# EAGLE schematic switch_hat (EAGLE 7.5.0)
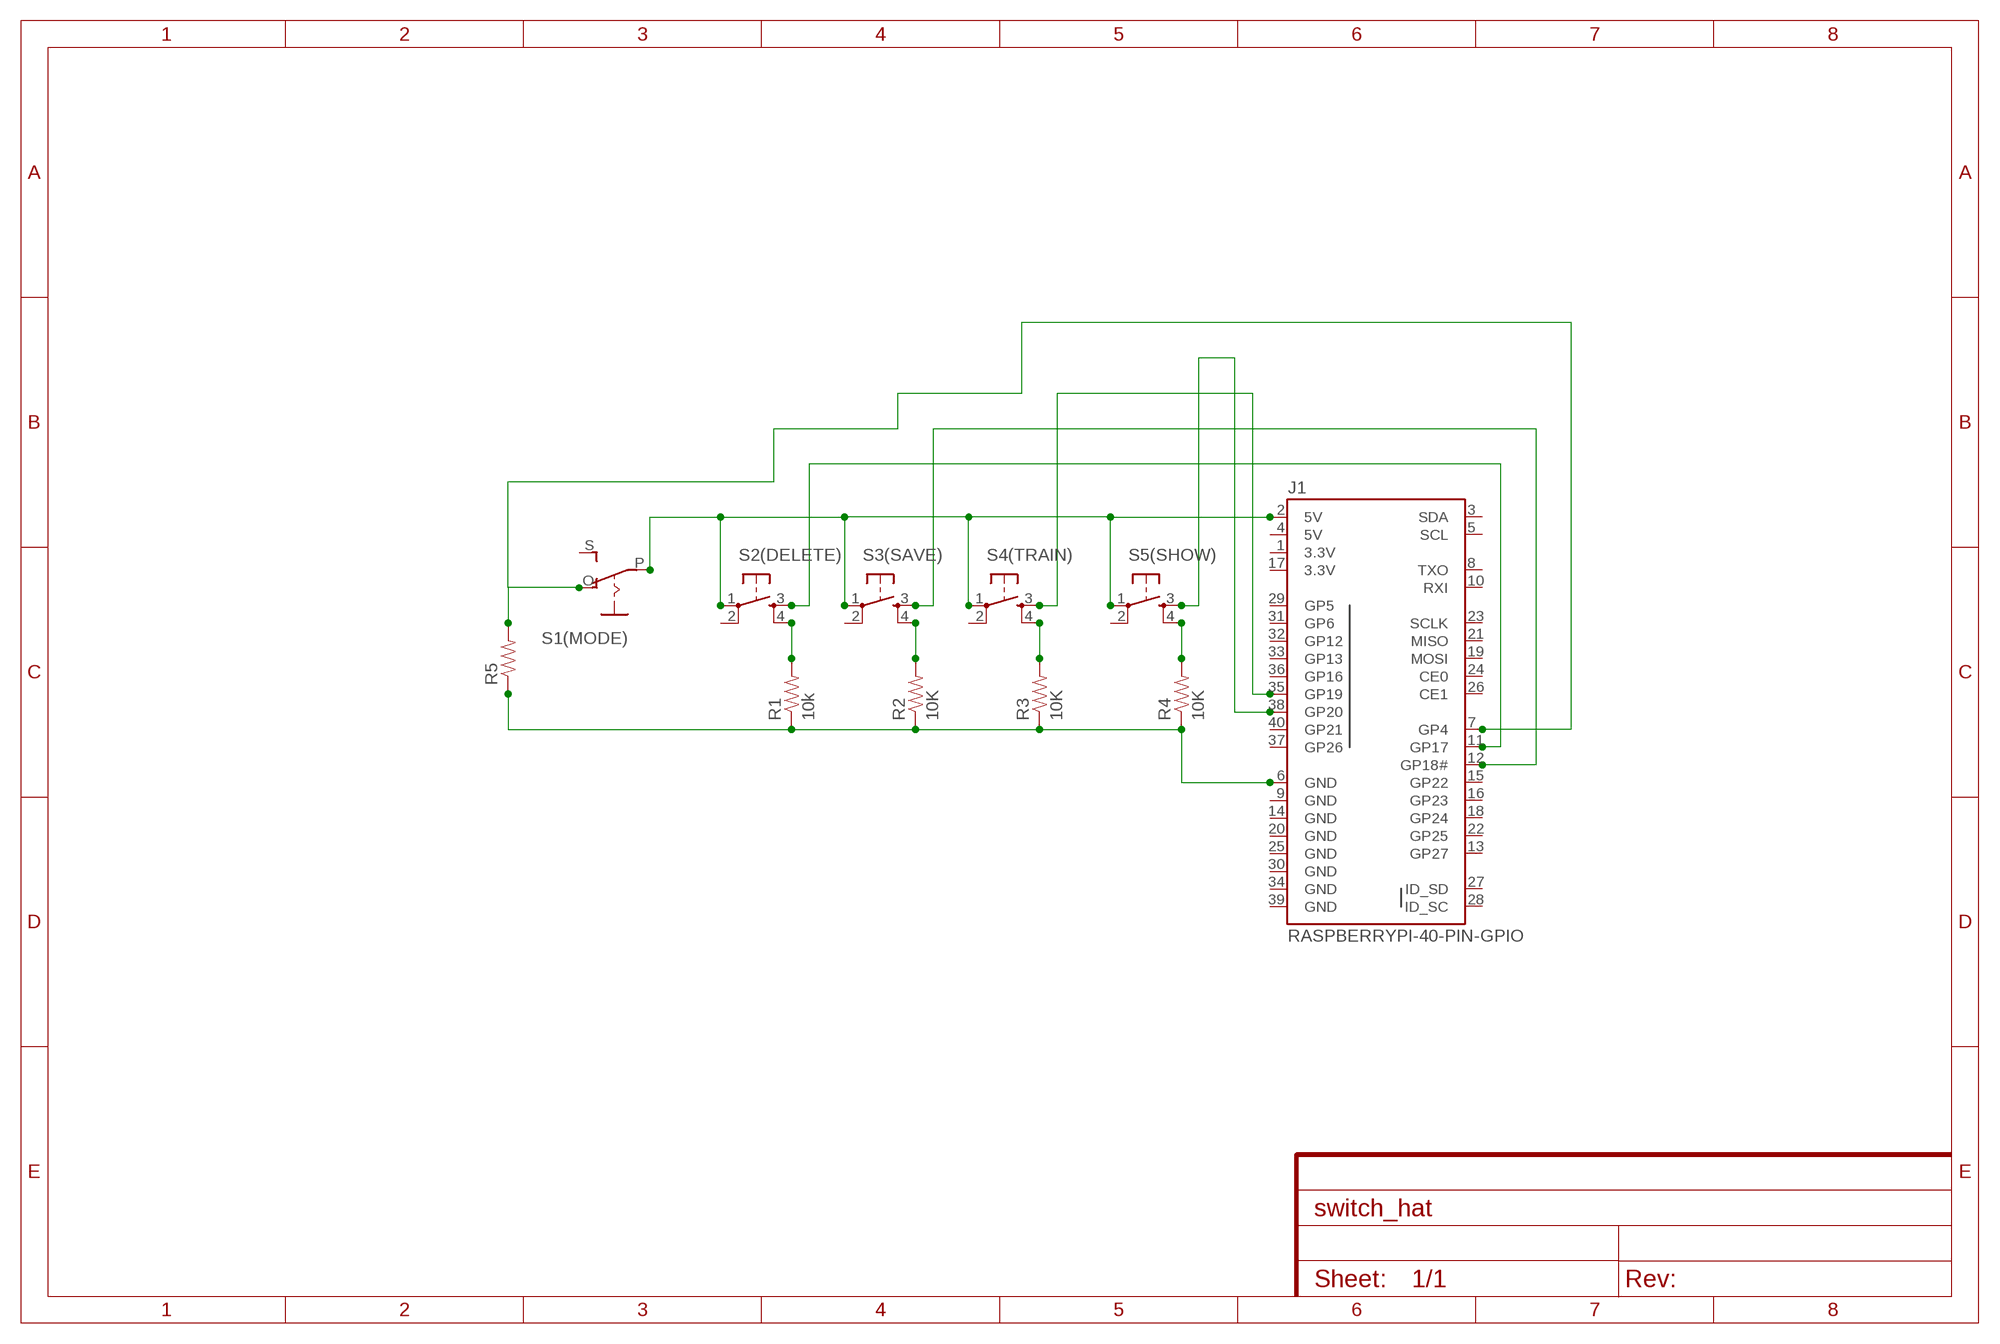
[diagram p0: schematic, sheet 1]

## Parts
J1  RASPBERRYPI-40-PIN-GPIO  [2X20-SHROUDED]
R1  10k  RESISTORPTH-1/4W  [AXIAL-0.4]
R2  10K  RESISTORPTH-1/4W  [AXIAL-0.4]
R3  10K  RESISTORPTH-1/4W  [AXIAL-0.4]
R4  10K  RESISTORPTH-1/4W  [AXIAL-0.4]
R5  RESISTORPTH-1/4W  [AXIAL-0.4]
S1(MODE)  EG1218S  [EG1218]
S2(DELETE)  TAC_SWITCHPTH  [TACTILE-PTH]
S3(SAVE)  TAC_SWITCHPTH  [TACTILE-PTH]
S4(TRAIN)  TAC_SWITCHPTH  [TACTILE-PTH]
S5(SHOW)  TAC_SWITCHPTH  [TACTILE-PTH]

## Nets
N$1: R1.P$2 S2(DELETE).4
N$2: R2.P$2 S3(SAVE).4
N$3: R3.P$2 S4(TRAIN).4
N$4: R4.P$2 S5(SHOW).4
N$5: J1.6(GND) R1.P$1 R2.P$1 R3.P$1 R4.P$1 R5.P$1
N$6: J1.7(GP4) R5.P$2 S1(MODE).O
N$7: J1.11(GP17) S2(DELETE).3
N$8: J1.2(5V) S1(MODE).P S2(DELETE).1 S3(SAVE).1 S4(TRAIN).1 S5(SHOW).1
N$9: J1.12(GP18#) S3(SAVE).3
N$10: J1.35(GP19) S4(TRAIN).3
N$11: J1.38(GP20) S5(SHOW).3
Unconnected: J1.3(SDA) J1.5(SCL) J1.8(TXO) J1.10(RXI) J1.13(GP27) J1.15(GP22) J1.16(GP23) J1.18(GP24) J1.19(MOSI) J1.21(MISO) J1.22(GP25) J1.23(SCLK) J1.24(CE0) J1.26(CE1) J1.27(ID_SD) J1.28(ID_SC) J1.29(GP5) J1.31(GP6) J1.32(GP12) J1.33(GP13) J1.36(GP16) J1.37(GP26) J1.40(GP21) S1(MODE).S S2(DELETE).2 S3(SAVE).2 S4(TRAIN).2 S5(SHOW).2

## Power pins joined to a net without a drawn wire
3.3V: J1.1(3.3V) J1.17(3.3V)
5V: J1.4(5V)
GND: J1.9(GND) J1.14(GND) J1.20(GND) J1.25(GND) J1.30(GND) J1.34(GND) J1.39(GND)

## Library data of the parts
J1 = SparkFun-Boards:RASPBERRYPI-40-PIN-GPIO: Second Generation Raspberry Pi GPIO Header 2x20 pin connector, as found on B, B+, A+ models.
R1-R5 = SparkFun-Resistors:RESISTOR: Resistor Basic schematic elements and footprints for 0603, 1206, and PTH resistors.
S1(MODE) = adafruit:EG1218: SLIDING SWITCH 0.1" spacing through hole, vertical SPDT slide switch http://www.ladyada.net/library/pcb/eaglelibrary.html
S2(DELETE) S3(SAVE) S4(TRAIN) S5(SHOW) = SparkFun-Retired:TAC_SWITCH: Momentary Switch Button commonly used for reset or general input. Spark Fun Electronics SKU : COM-00097 SMT- SWCH-08247